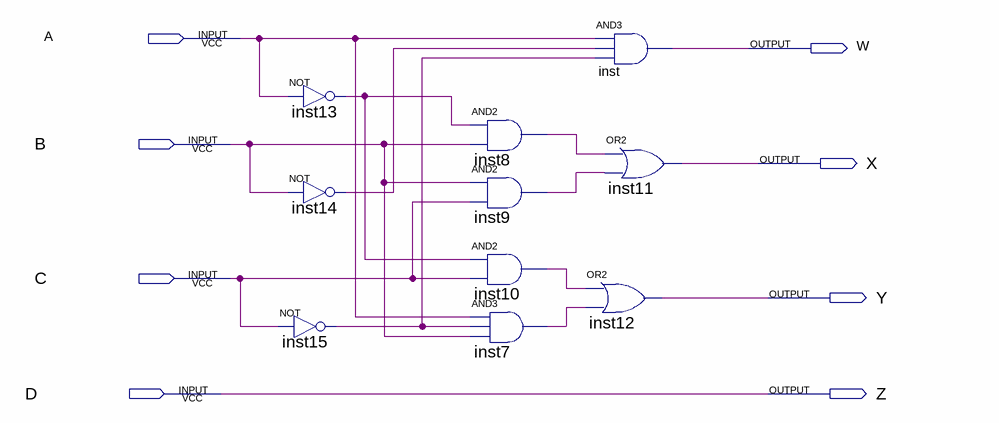
[diagram p0: schematic sheet]
// Quartus schematic decoder1.bdf as structural Verilog: 10 symbols, 8 pins
module decoder1 (
  input  A,
  input  B,
  input  C,
  input  D,
  output W,
  output X,
  output Y,
  output Z
);

  wire inst7_out, inst8_out, inst9_out, inst10_out, inst13_out, inst14_out, inst15_out;

  not inst13 (inst13_out, A);
  not inst14 (inst14_out, B);
  not inst15 (inst15_out, C);
  and inst8 (inst8_out, inst13_out, B);
  and inst9 (inst9_out, B, C);
  and inst10 (inst10_out, inst13_out, C);
  and inst7 (inst7_out, A, inst15_out, B);
  and inst (W, A, inst14_out, inst15_out);
  or inst11 (X, inst8_out, inst9_out);
  or inst12 (Y, inst10_out, inst7_out);

  assign Z = D;
endmodule
